# Altium project ESP-LED.PrjPcb
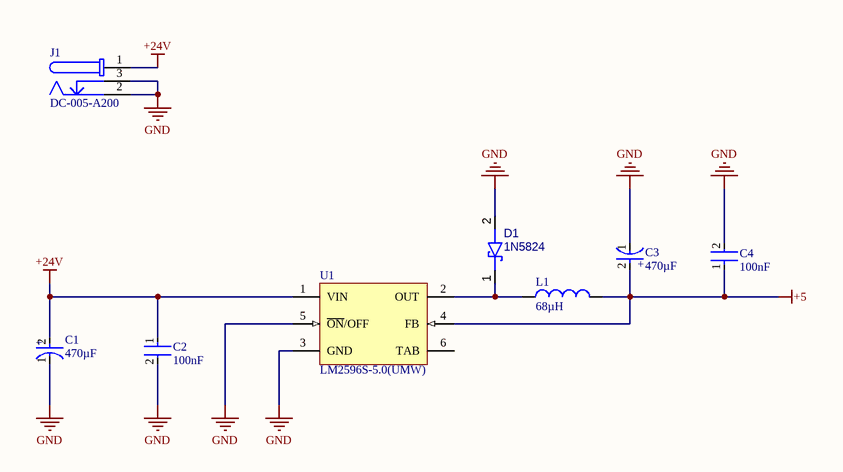
[diagram p0: Power.SchDoc]
3 sheets, 37 parts. Net scope: flat (ports and power ports of the same name join across sheets).
Board file: PCB1.PcbDoc
Sheets:
  Power.SchDoc
  ESP32_Pins.SchDoc
  MosFets.SchDoc

## Sheet Power.SchDoc
size A4; SheetNumber: 1; SheetTotal: 3

### Parts
C1  value 470µF  [FP-A750MV227M1HAAE020-MFG]  (hidden comment: ERS1VM471G16OT)
C2  value 100nF  [FP-CC0603-DA-IPC_B]  (hidden comment: CC0603KRX7R9BB104)
C3  value 470µF  [FP-A750MV227M1HAAE020-MFG]  (hidden comment: ERS1VM471G16OT)
C4  value 100nF  [FP-CC0603-DA-IPC_B]  (hidden comment: CC0603KRX7R9BB104)
D1  1N5824  [FP-017AF-MFG]
J1  DC-005-A200  [694108301002]
L1  value 68µH  [CAPM115100X500N]  (hidden comment: YSPI1050-680M)
U1  LM2596S-5.0(UMW)  [KTT0005B_L]

### Nets
+5: C3.2(A) C4.1 L1.2 U1.4(FB)
+24V: C1.2(A) C2.1 J1.1 U1.1(VIN)
GND: C1.1(C) C2.2 C3.1(C) C4.2 D1.2(A) J1.2 J1.3 U1.3(GND) U1.5(~{ON}/OFF)
NetD1_1: D1.1(K) L1.1 U1.2(OUT)

Not connected (* = marked no-connect by the designer): U1 6(TAB)

### Notes on the sheet
- (in symbol CMP-001-00083-1) +
- (in symbol CMP-001-00083-2) +

### Library data of the parts
C1 = CMP-001-00083-2: 10mm 16mm 35V 470uF 5mm 7000hrs@105℃ ±20% 插件,D10xL16mm Aluminum Electrolytic Capacitors - Leaded ROHS; Manufacturer: AISHI(Aihua Group); Dissipation Factor: 12%; Voltage Rating (DC): 50V; Ripple Current: 215mA; Leakage Current: 2.2mA; Life (Hours): 2000hours; ESR (Equivalent Series Resistance): 20mΩ; Length: 14mm; Case/Package: Radial; Tolerance: 20%; REACH SVHC: Yes; Diameter: 10mm; Voltage Rating: 35V; Height: 16mm; Packaging: Bulk; Lifecycle Status: Production; Max Operating Temperature: 105°C; Terminal Pitch: 5mm; Number of Terminals: 2; Min Operating Temperature: -55°C; RoHS: Compliant; MFR.Part #: ERS1VM471G16OT; JLCPCB Part #: C106703
C2 = CMP-001-00084-2: Multilayer Ceramic Capacitor, CC Series, 0.1 - F, - 10%, X7R, 50 V, 0603 [1608 Metric]; Manufacturer: YAGEO; Voltage Rating (DC): 50V; Pins: 2; Case Code (Imperial): 0603; Length: 1.6mm; Case Code (Metric): 1608; Introduction Date: 2005-08-18; Mounting Technology: Surface Mount; Case/Package: 0603; Country of Origin: Mainland China, Taiwan; Voltage Rating: 50V; Dielectric Material: Ceramic; Halogen Free: Halogen Free; Thickness: 889µm; Number of Terminals: 2; Max Operating Temperature: 125°C; REACH SVHC: Yes; Depth: 800µm; Harmonized Tariff Schedule (HTS) Code: 8532.24.00.20; RoHS: Compliant; Width: 800µm; Min Operating Temperature: -55°C; Material: Ceramic; Lifecycle Status: Production; Termination: SMD/SMT; Voltage: 50V; Lead Free: Lead Free; Dielectric: X7R; Tolerance: 10%; Height: 800µm; Radiation Hardening: No; Schedule B: 8532240020, 8532240020; China RoHS: Compliant; Export Control Classification Number (ECCN) Code: EAR99; MFR.Part #: CC0603KRX7R9BB104; JLCPCB Part #: C14663
C3 = CMP-001-00083-1: 10mm 16mm 35V 470uF 5mm 7000hrs@105℃ ±20% 插件,D10xL16mm Aluminum Electrolytic Capacitors - Leaded ROHS; Dissipation Factor: 12%; Voltage Rating (DC): 50V; Ripple Current: 215mA; Leakage Current: 2.2mA; Life (Hours): 2000hours; ESR (Equivalent Series Resistance): 20mΩ; Length: 14mm; Case/Package: Radial; Tolerance: 20%; REACH SVHC: Yes; Diameter: 10mm; Voltage Rating: 35V; Height: 16mm; Packaging: Bulk; Lifecycle Status: Production; Max Operating Temperature: 105°C; Terminal Pitch: 5mm; Number of Terminals: 2; Min Operating Temperature: -55°C; RoHS: Compliant
C4 = CMP-001-00084-1: Multilayer Ceramic Capacitor, CC Series, 0.1 - F, - 10%, X7R, 50 V, 0603 [1608 Metric]; Voltage Rating (DC): 50V; Pins: 2; Case Code (Imperial): 0603; Length: 1.6mm; Case Code (Metric): 1608; Introduction Date: 2005-08-18; Mounting Technology: Surface Mount; Case/Package: 0603; Country of Origin: Mainland China, Taiwan; Voltage Rating: 50V; Dielectric Material: Ceramic; Halogen Free: Halogen Free; Thickness: 889µm; Number of Terminals: 2; Max Operating Temperature: 125°C; REACH SVHC: Yes; Depth: 800µm; Harmonized Tariff Schedule (HTS) Code: 8532.24.00.20; RoHS: Compliant; Width: 800µm; Min Operating Temperature: -55°C; Material: Ceramic; Lifecycle Status: Production; Termination: SMD/SMT; Voltage: 50V; Lead Free: Lead Free; Dielectric: X7R; Tolerance: 10%; Height: 800µm; Radiation Hardening: No; Schedule B: 8532240020, 8532240020; China RoHS: Compliant; Export Control Classification Number (ECCN) Code: EAR99
D1 = CMP-004-00031-2: -55℃~+150℃ 150A 30V 500uA@30V 550mV@5A 5A Independent DO-201AD Schottky Diodes ROHS; Manufacturer: FUXINSEMI; Average Rectified Current: 3A; Max Power Dissipation: 6.25W; Max Junction Temperature (Tj): 150°C; Number of Elements: 1; Reverse Voltage: 400V; Forward Voltage: 550mV; Max Forward Surge Current (Ifsm): 125A; Element Configuration: Single; Natural Thermal Resistance: 20°C/W; Reverse Recovery Time: 50ns; Polarity: Standard; Value: 75pF; Number of Terminals: 2; Pins: 2; Output Current: 5A; Height: 5.6mm; Power Dissipation: 6.25W; Mounting Technology: Through Hole; Max Reverse Voltage (DC): 400V; Diameter: 5.6mm; Voltage Rating (DC): 400V; Max Surge Current: 150A; Max Output current: 3A; Recovery Time: 50ns; MFR.Part #: 1N5824; JLCPCB Part #: C7503125; Package: DO-201AD; Max Operating Temperature: 150°C; Min Operating Temperature: -65°C; Case/Package: Axial; Forward Current: 5A; Current Rating: 3A
J1 = CMP-002-00073-1: -20℃~+70℃ 2mm 30V 3A 6.4mm DC Power Jack Right Angle 插件 DC Power Connectors ROHS; Manufacturer Lifecycle Status: ACTIVE; Manufacturer: XUNPU; YEOL: 1 = Estimated lifetime > 10 years; Number of Contacts: 3; Shielding: Unshielded; Insulation Resistance: 100MΩ; Operating Supply Voltage: 24V; Gender: Male; Current Rating: 3A; Color: Black; Flammability Rating: UL94 V-0; JLCPCB Part #: C720557; Contact Gender: Female; Contact Material: Gold, Tin; Termination: Through Hole; MFR.Part #: DC-005-A200; RoHS: Compliant; REACH SVHC: Unknown; Connector Type: Power; Contact Plating: Tin; Housing Material: Polyamide; Max Operating Temperature: 70°C; Mounting Technology: Through Hole; Voltage Rating: 30V; Lifecycle Status: Production; Packaging: Bulk; Height: 11mm; Min Operating Temperature: -20°C
L1 = CMP-006-00021-1: 240mΩ 3A 4A 68uH Molded Inductor ±20% SMD,11.5x10mm Power Inductors ROHS; Manufacturer: YJYCOIN; Shielding: Unshielded; Test Frequency: 100kHz; Number of Circuits: 1; Height: 5mm; Min Operating Temperature: -40°C; JLCPCB Part #: C497902; Length: 11.5mm; MFR.Part #: YSPI1050-680M; DC Resistance (DCR): 240mΩ; Max Operating Temperature: 125°C; Number of Terminals: 2; Mounting Technology: SMD; Tolerance: 20%; Width: 10mm; Max Current Rating: 4A; Package: SMD,11.5x10mm; Pins: 2
U1 = CMP-031-00007-1: -40℃~+125℃@(TA) 1 150kHz 3A 5V 7V~40V 80uA Buck Buck Built-in Fixed No TO-263-5 DC-DC Converters ROHS; Manufacturer: UMW(Youtai Semiconductor Co., Ltd.); Number of Outputs: 1; Max Supply Voltage: 40V; Min Input Voltage: 4.5V; Efficiency: 80%; Switching Frequency: 173kHz; Quiescent Current: 5mA; Height: 4.83mm; Min Operating Temperature: -40°C; MFR.Part #: LM2596S-5.0(UMW); Nominal Output Voltage: 5V; Weight: 113.398093g; Mounting Technology: Surface Mount; Pins: 5; Frequency: 150kHz; Topology: Buck; Width: 8.42mm; Number of Channels: 1; Output Type: Fixed; Max Output current: 3A; Case/Package: TO-263; Output Voltage: 5V; Packaging: Cut Tape; Contact Plating: Tin; Max Operating Temperature: 125°C; JLCPCB Part #: C347421; Thickness: 4.58mm; Length: 10.16mm; Output Current: 3A; Operating Supply Voltage: 40V

## Sheet ESP32_Pins.SchDoc
size A4; SheetNumber: 2; SheetTotal: 3
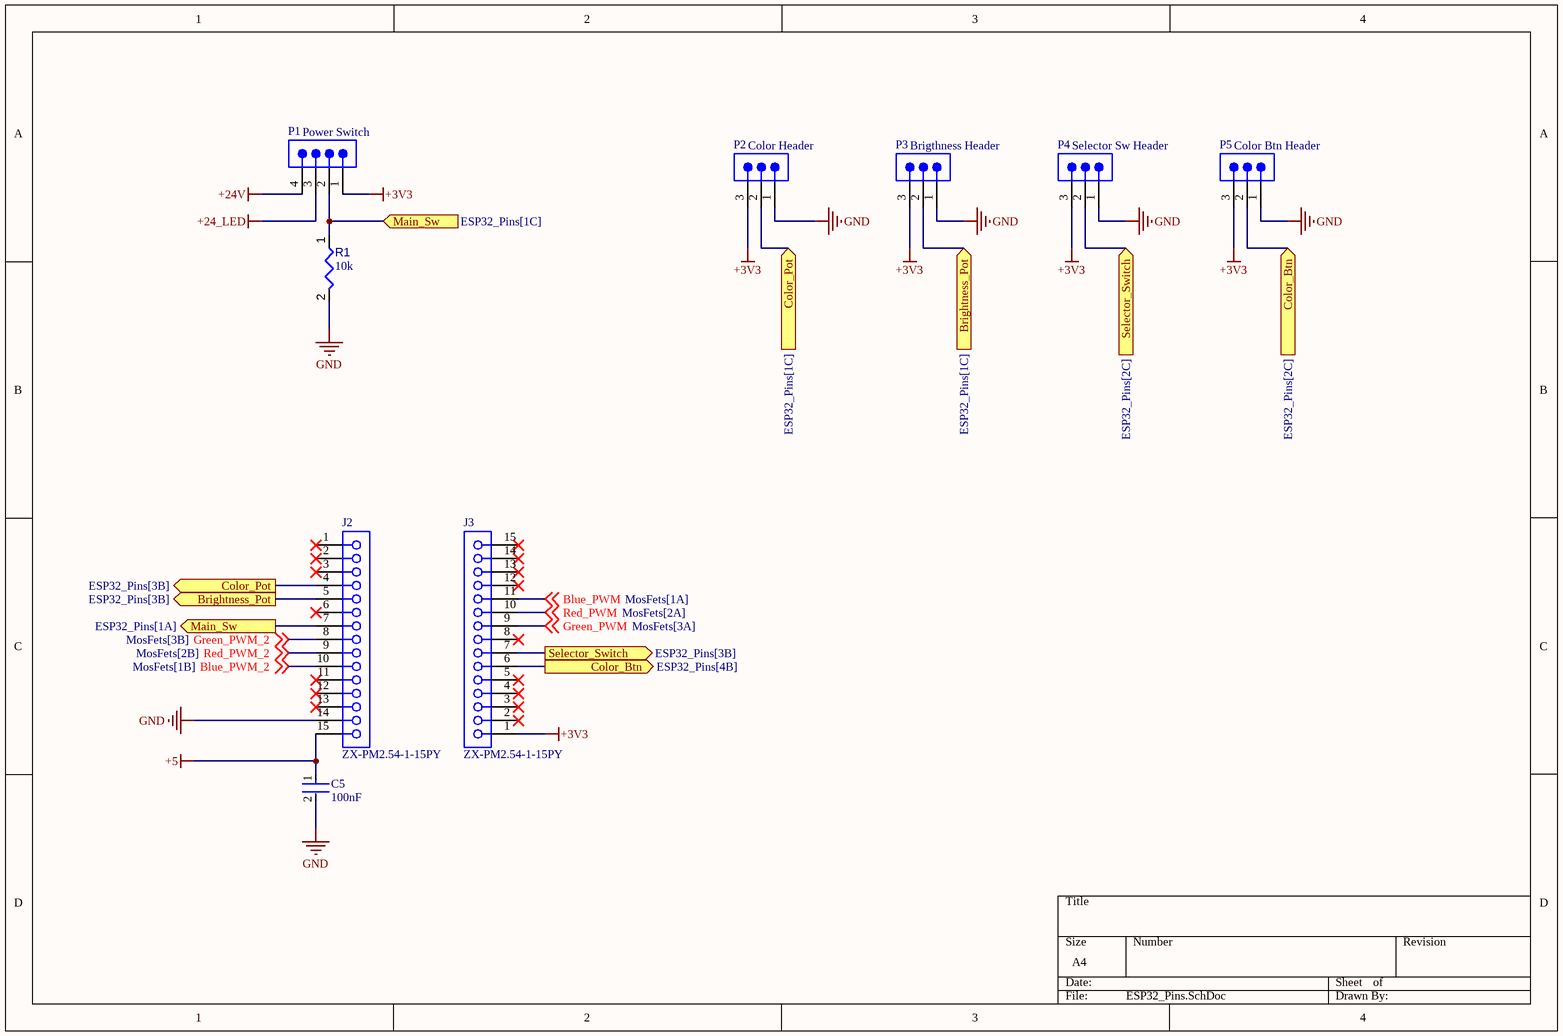
[diagram p1: ESP32_Pins.SchDoc]

### Parts
C5  value 100nF  [FP-CC0603-DA-IPC_B]  (hidden comment: CC0603KRX7R9BB104)
J2  ZX-PM2.54-1-15PY  [68000-115HLF_MFG]
J3  ZX-PM2.54-1-15PY  [68000-115HLF_MFG]
P1  Power Switch  [SMTC-TSW-104-08-X-S]
P2  Color Header  [FP-TSW-103-14-G-S-MFG]
P3  Brigthness Header  [FP-TSW-103-14-G-S-MFG]
P4  Selector Sw Header  [FP-TSW-103-14-G-S-MFG]
P5  Color Btn Header  [FP-TSW-103-14-G-S-MFG]
R1  value 10k  [FP-AC0603-IPC_C]  (hidden comment: 0603WAF1002T5E)

### Ports
Brightness_Pot (in, see ESP32_Pins[1C]), Brightness_Pot (out, see ESP32_Pins[3B]), Color_Btn (in, see ESP32_Pins[2C]), Color_Btn (out, see ESP32_Pins[4B]), Color_Pot (in, see ESP32_Pins[1C]), Color_Pot (out, see ESP32_Pins[3B]), Main_Sw (in, see ESP32_Pins[1C]), Main_Sw (out, see ESP32_Pins[1A]), Selector_Switch (in, see ESP32_Pins[2C]), Selector_Switch (out, see ESP32_Pins[3B])

### Nets
+3V3: J3.1 P1.1 P2.3 P3.3 P4.3 P5.3
+5: C5.1 J2.15
+24_LED: P1.3
+24V: P1.4
GND: C5.2 J2.14 P2.1 P3.1 P4.1 P5.1 R1.2
Blue_PWM: J3.11 ; off-sheet Blue_PWM
Blue_PWM_2: J2.10 ; off-sheet Blue_PWM_2
Green_PWM: J3.9 ; off-sheet Green_PWM
Green_PWM_2: J2.8 ; off-sheet Green_PWM_2
Red_PWM: J3.10 ; off-sheet Red_PWM
Red_PWM_2: J2.9 ; off-sheet Red_PWM_2
NetJ2_4: J2.4 P2.2 ; port Color_Pot
NetJ2_5: J2.5 P3.2 ; port Brightness_Pot
NetJ2_7: J2.7 P1.2 R1.1 ; port Main_Sw
NetJ3_6: J3.6 P5.2 ; port Color_Btn
NetJ3_7: J3.7 P4.2 ; port Selector_Switch

Not connected (* = marked no-connect by the designer): J2 1* 2* 3* 6* 11* 12* 13*; J3 2* 3* 4* 5* 8* 12* 13* 14* 15*

### Library data of the parts
C5 = CMP-001-00084-1: as C4 on sheet Power; Pins: 2; Case Code (Imperial): 0603; Length: 1.6mm; Case Code (Metric): 1608; Introduction Date: 2005-08-18; Mounting Technology: Surface Mount; Case/Package: 0603; Country of Origin: Mainland China, Taiwan; Voltage Rating: 50V; Dielectric Material: Ceramic; Halogen Free: Halogen Free; Thickness: 889µm; Number of Terminals: 2; Max Operating Temperature: 125°C; REACH SVHC: Yes; Depth: 800µm; Harmonized Tariff Schedule (HTS) Code: 8532.24.00.20; RoHS: Compliant; Width: 800µm; Min Operating Temperature: -55°C; Material: Ceramic; Lifecycle Status: Production; Termination: SMD/SMT; Voltage: 50V; Lead Free: Lead Free; Dielectric: X7R; Tolerance: 10%; Height: 800µm; Radiation Hardening: No; Schedule B: 8532240020, 8532240020; China RoHS: Compliant; Export Control Classification Number (ECCN) Code: EAR99
J2 J3 = CMP-002-00071-2: -40℃~+105℃ 1 15P 1x15P 2.54mm 3.2mm 3A 8.5mm Brass Gold Square Hole Through Hole Top 插件,P=2.54mm Female Headers ROHS; Manufacturer: Megastar; Connector Type: Plugin; Max Current Rating: 3A; MFR.Part #: ZX-PM2.54-1-15PY; Gender: Female; JLCPCB Part #: C7499333; Case/Package: Plugin,P=2.54mm; RoHS Compliant: Yes; Min Operating Temperature: -40°C; Pins: 15; Mounting Technology: Through Hole; Max Operating Temperature: 105°C
P1 = CMP-002-00072-1: Conn Unshrouded Header HDR 4 POS 2.54mm Solder ST Top Entry Thru-Hole Bulk; Connector Type: Male Pin; Max Current Rating: 7.6A; Gender: Male; Min Operating Temperature: -55°C; Case/Package: Plugin,P=2.54mm; Pitch: 2.54mm; Max Operating Temperature: 125°C; Mounting Technology: Throgh Hole; Pins: 4; Contact Material: Bronze
P2-P5 = CMP-002-00074-2: Pin Header, Board-to-Board, 2.54 mm, 1 Rows, 3 Contacts, Through Hole, TSW; Connector Type: Male Pin; Pitch: 2.54mm; Max Current Rating: 7.6A; Gender: Male; Mounting Technology: Through Hole; Max Operating Temperature: 125°C; Min Operating Temperature: -55°C; Pins: 3; Case/Package: Plugin,P=2.54mm
R1 = CMP-009-00177-1: Res Thick Film 0603 10K Ohm 1% 0.1W(1/10W) ±100ppm/C Pad SMD; Tolerance: 5%; Voltage Rating: 75V; Max Operating Temperature: 155°C; Mounting Technology: Surface Mount; Case/Package: 0603; Min Operating Temperature: -55°C

## Sheet MosFets.SchDoc
size A4; SheetNumber: 3; SheetTotal: 3
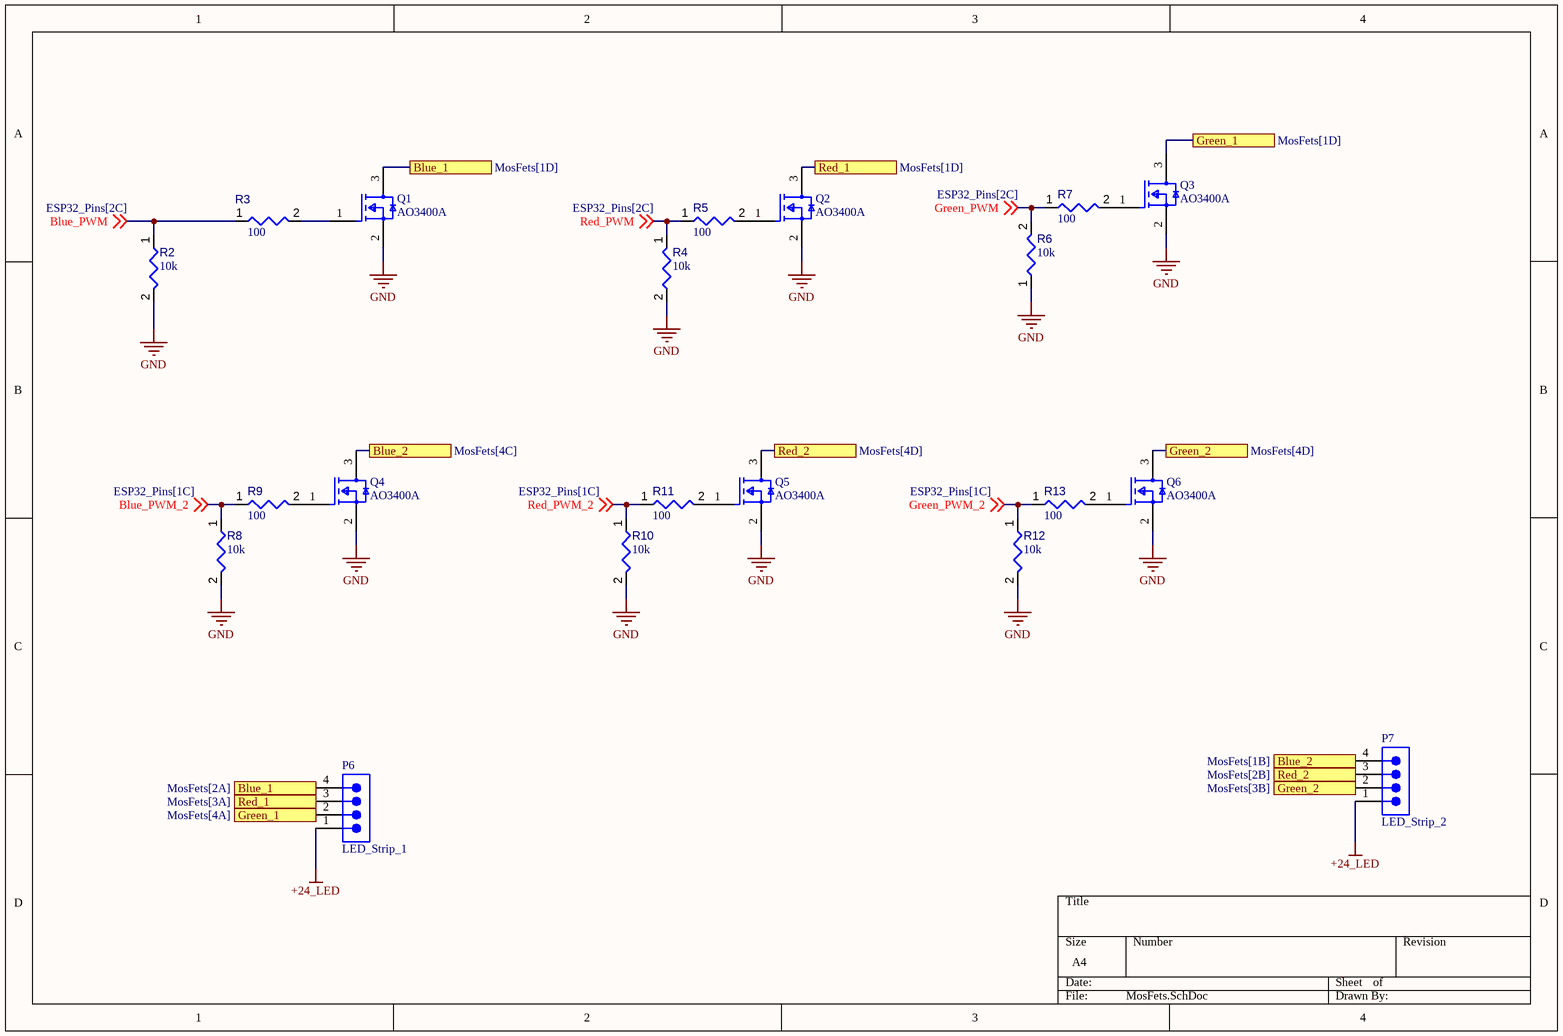
[diagram p2: MosFets.SchDoc]

### Parts
P6  LED_Strip_1  [SMTC-TSW-104-08-X-S]
P7  LED_Strip_2  [SMTC-TSW-104-08-X-S]
Q1  AO3400A  [FP-SOT23-IPC_C]
Q2  AO3400A  [FP-SOT23-IPC_C]
Q3  AO3400A  [FP-SOT23-IPC_C]
Q4  AO3400A  [FP-SOT23-IPC_C]
Q5  AO3400A  [FP-SOT23-IPC_C]
Q6  AO3400A  [FP-SOT23-IPC_C]
R2  value 10k  [FP-AC0603-IPC_C]  (hidden comment: 0603WAF1002T5E)
R3  value 100  [FP-AC0603-IPC_C]  (hidden comment: 0603WAF1000T5E)
R4  value 10k  [FP-AC0603-IPC_C]  (hidden comment: 0603WAF1002T5E)
R5  value 100  [FP-AC0603-IPC_C]  (hidden comment: 0603WAF1000T5E)
R6  value 10k  [FP-AC0603-IPC_C]  (hidden comment: 0603WAF1002T5E)
R7  value 100  [FP-AC0603-IPC_C]  (hidden comment: 0603WAF1000T5E)
R8  value 10k  [FP-AC0603-IPC_C]  (hidden comment: 0603WAF1002T5E)
R9  value 100  [FP-AC0603-IPC_C]  (hidden comment: 0603WAF1000T5E)
R10  value 10k  [FP-AC0603-IPC_C]  (hidden comment: 0603WAF1002T5E)
R11  value 100  [FP-AC0603-IPC_C]  (hidden comment: 0603WAF1000T5E)
R12  value 10k  [FP-AC0603-IPC_C]  (hidden comment: 0603WAF1002T5E)
R13  value 100  [FP-AC0603-IPC_C]  (hidden comment: 0603WAF1000T5E)

### Ports
Blue_1 (see MosFets[1D]), Blue_1 (see MosFets[2A]), Blue_2 (see MosFets[1B]), Blue_2 (see MosFets[4C]), Green_1 (see MosFets[1D]), Green_1 (see MosFets[4A]), Green_2 (see MosFets[3B]), Green_2 (see MosFets[4D]), Red_1 (see MosFets[1D]), Red_1 (see MosFets[3A]), Red_2 (see MosFets[2B]), Red_2 (see MosFets[4D])

### Nets
+24_LED: P6.1 P7.1
GND: Q1.2(S) Q2.2(S) Q3.2(S) Q4.2(S) Q5.2(S) Q6.2(S) R2.2 R4.2 R6.1 R8.2 R10.2 R12.2
Blue_PWM: R2.1 R3.1 ; off-sheet Blue_PWM
Blue_PWM_2: R8.1 R9.1 ; off-sheet Blue_PWM_2
Green_PWM: R6.2 R7.1 ; off-sheet Green_PWM
Green_PWM_2: R12.1 R13.1 ; off-sheet Green_PWM_2
Red_PWM: R4.1 R5.1 ; off-sheet Red_PWM
Red_PWM_2: R10.1 R11.1 ; off-sheet Red_PWM_2
NetP6_2: P6.2 Q3.3(D) ; port Green_1
NetP6_3: P6.3 Q2.3(D) ; port Red_1
NetP6_4: P6.4 Q1.3(D) ; port Blue_1
NetP7_2: P7.2 Q6.3(D) ; port Green_2
NetP7_3: P7.3 Q5.3(D) ; port Red_2
NetP7_4: P7.4 Q4.3(D) ; port Blue_2
NetQ1_1: Q1.1(G) R3.2
NetQ2_1: Q2.1(G) R5.2
NetQ3_1: Q3.1(G) R7.2
NetQ4_1: Q4.1(G) R9.2
NetQ5_1: Q5.1(G) R11.2
NetQ6_1: Q6.1(G) R13.2

### Library data of the parts
P6 P7 = CMP-002-00072-1: as P1 on sheet ESP32_Pins; Min Operating Temperature: -55°C; Case/Package: Plugin,P=2.54mm; Pitch: 2.54mm; Max Operating Temperature: 125°C; Mounting Technology: Throgh Hole; Pins: 4; Contact Material: Bronze
Q1 = CMP-013-00034-2: -55℃~+150℃ 1 N-channel 1.45V 1.4W 30V 48mΩ@2.5V 5.7A 50pF 630pF 75pF 7nC@10V N-Channel SOT-23 MOSFETs ROHS; Manufacturer: Alpha & Omega Semicon; Gate to Source Voltage (Vgs): 12V; Turn-Off Delay Time: 25ns; Number of Elements: 1; Threshold Voltage: 650mV; Turn-On Delay Time: 3ns; Max Junction Temperature (Tj): 150°C; Drain to Source Resistance: 26.5mΩ; Number of Terminals: 3; Input Capacitance: 630pF; Case/Package: SOT-23; Lifecycle Status: Production; Min Operating Temperature: -55°C; Export Control Classification Number (ECCN) Code: EAR99; Max Power Dissipation: 1.4W; Max Operating Temperature: 150°C; Continuous Drain Current (ID): 5.7A; Power Dissipation: 1.4W; Introduction Date: 2007-04-17; Drain to Source Breakdown Voltage: 30V; Radiation Hardening: No; Height: 1.25mm; Lead Free: Lead Free; RoHS: Compliant; Min Breakdown Voltage: 30V; REACH SVHC: Yes; Drain to Source Voltage (Vdss): 30V; Number of Channels: 1; Pins: 3; Schedule B: 8541290080, 8541290080; Rds On Max: 26.5mΩ; Country of Origin: Mainland China; Mounting Technology: Surface Mount; MFR.Part #: AO3400A; JLCPCB Part #: C20917
Q2-Q6 = CMP-013-00034-1: Trans MOSFET N-CH 30V 5.7A 3-Pin SOT-23; Input Capacitance: 630pF; Max Power Dissipation: 1.4W; Gate to Source Voltage (Vgs): 12V; Turn-Off Delay Time: 25ns; Number of Elements: 1; Threshold Voltage: 650mV; Turn-On Delay Time: 3ns; Max Junction Temperature (Tj): 150°C; Drain to Source Resistance: 26.5mΩ; Number of Terminals: 3; Case/Package: SOT-23; Lifecycle Status: Production; Min Operating Temperature: -55°C; Export Control Classification Number (ECCN) Code: EAR99; Max Operating Temperature: 150°C; Continuous Drain Current (ID): 5.7A; Power Dissipation: 1.4W; Introduction Date: 2007-04-17; Drain to Source Breakdown Voltage: 30V; Radiation Hardening: No; Height: 1.25mm; Lead Free: Lead Free; RoHS: Compliant; Min Breakdown Voltage: 30V; REACH SVHC: Yes; Drain to Source Voltage (Vdss): 30V; Number of Channels: 1; Pins: 3; Schedule B: 8541290080, 8541290080; Rds On Max: 26.5mΩ; Country of Origin: Mainland China; Mounting Technology: Surface Mount
R2 R4 R8 R10 R12 = CMP-009-00177-1: as R1 on sheet ESP32_Pins; Max Operating Temperature: 155°C; Mounting Technology: Surface Mount; Case/Package: 0603; Min Operating Temperature: -55°C
R3 R5 R7 R9 R11 R13 = CMP-009-00178-1: -55℃~+155℃ 100mW 100Ω 75V Thick Film Resistor ±1% ±100ppm/℃ 0603 Chip Resistor - Surface Mount ROHS; Manufacturer: UNI-ROYAL(Uniroyal Elec); Pins: 2; Power: 100mW; JLCPCB Part #: C22775; Min Operating Temperature: -55°C; MFR.Part #: 0603WAF1000T5E; Case/Package: 0603; Mounting Technology: SMD; Max Operating Temperature: 155°C; Tolerance: 1%; Voltage Rating: 75V
R6 = CMP-009-00177-2: Res Thick Film 0603 10K Ohm 1% 0.1W(1/10W) ±100ppm/C Pad SMD; Manufacturer: UNI-ROYAL(Uniroyal Elec); Tolerance: 5%; Voltage Rating: 75V; Max Operating Temperature: 155°C; Mounting Technology: Surface Mount; Case/Package: 0603; Min Operating Temperature: -55°C; JLCPCB Part #: C25804; MFR.Part #: 0603WAF1002T5E

## Nets that join several sheets
+5: Power (C3.2 C4.1 L1.2 U1.4), ESP32_Pins (C5.1 J2.15)
+24_LED: ESP32_Pins (P1.3), MosFets (P6.1 P7.1)
+24V: Power (C1.2 C2.1 J1.1 U1.1), ESP32_Pins (P1.4)
GND: Power (9 pins), ESP32_Pins (7 pins), MosFets (12 pins)
Blue_PWM: ESP32_Pins (J3.11), MosFets (R2.1 R3.1)
Blue_PWM_2: ESP32_Pins (J2.10), MosFets (R8.1 R9.1)
Green_PWM: ESP32_Pins (J3.9), MosFets (R6.2 R7.1)
Green_PWM_2: ESP32_Pins (J2.8), MosFets (R12.1 R13.1)
Red_PWM: ESP32_Pins (J3.10), MosFets (R4.1 R5.1)
Red_PWM_2: ESP32_Pins (J2.9), MosFets (R10.1 R11.1)